# EAGLE design ControlBoardUsb (EAGLE 7.2.0)
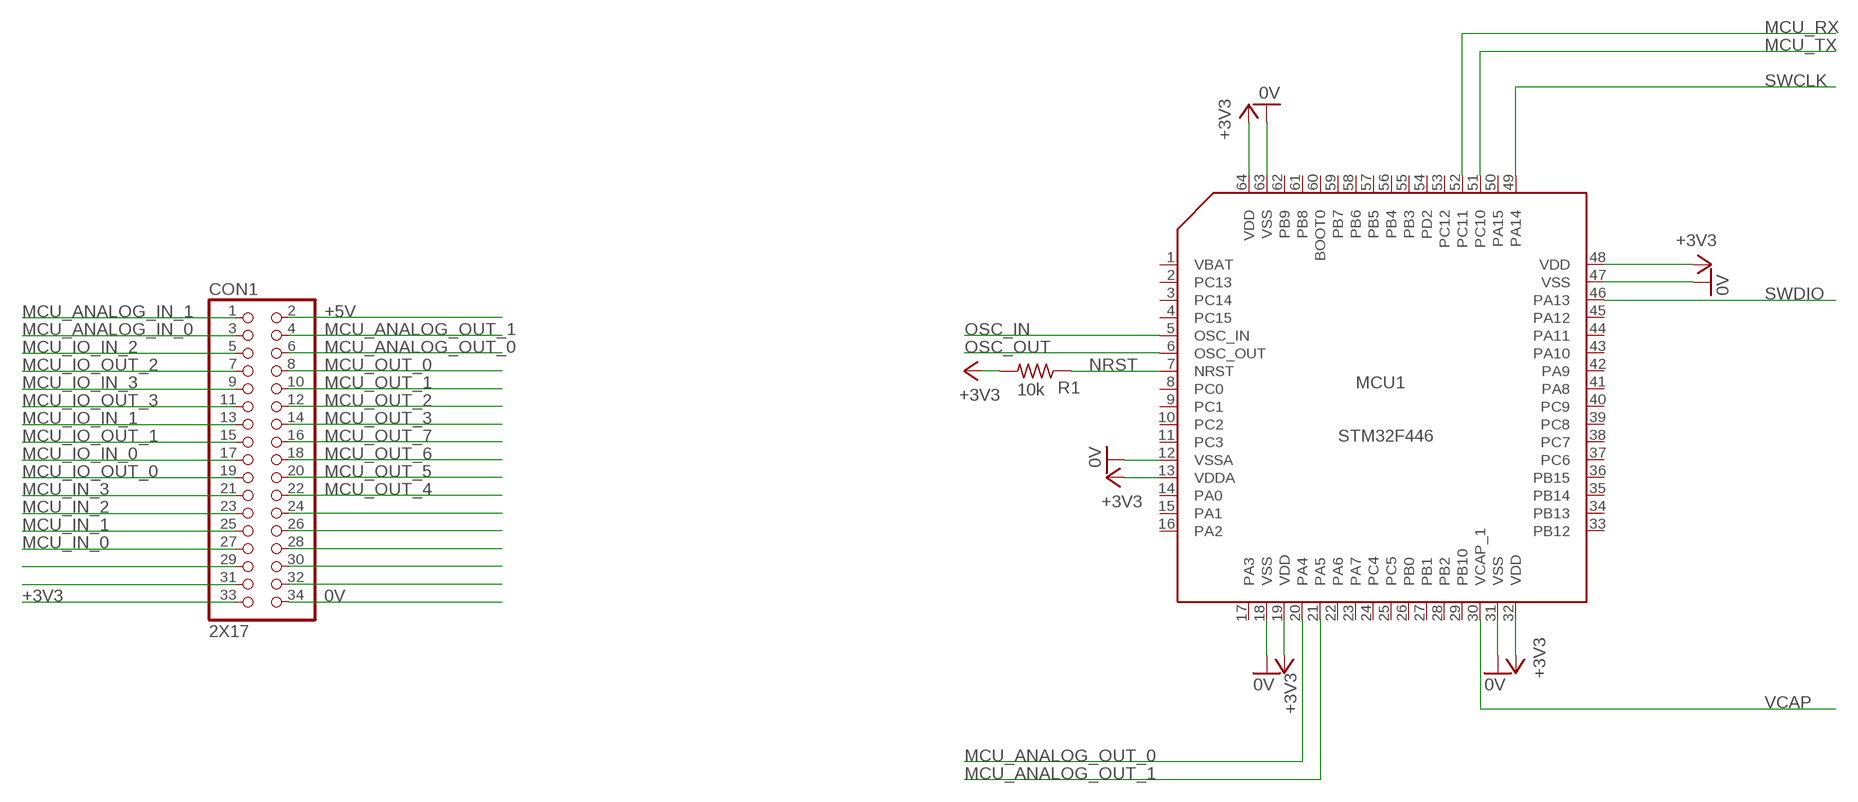
[diagram p0: schematic, sheet 1, part 1 of 2]
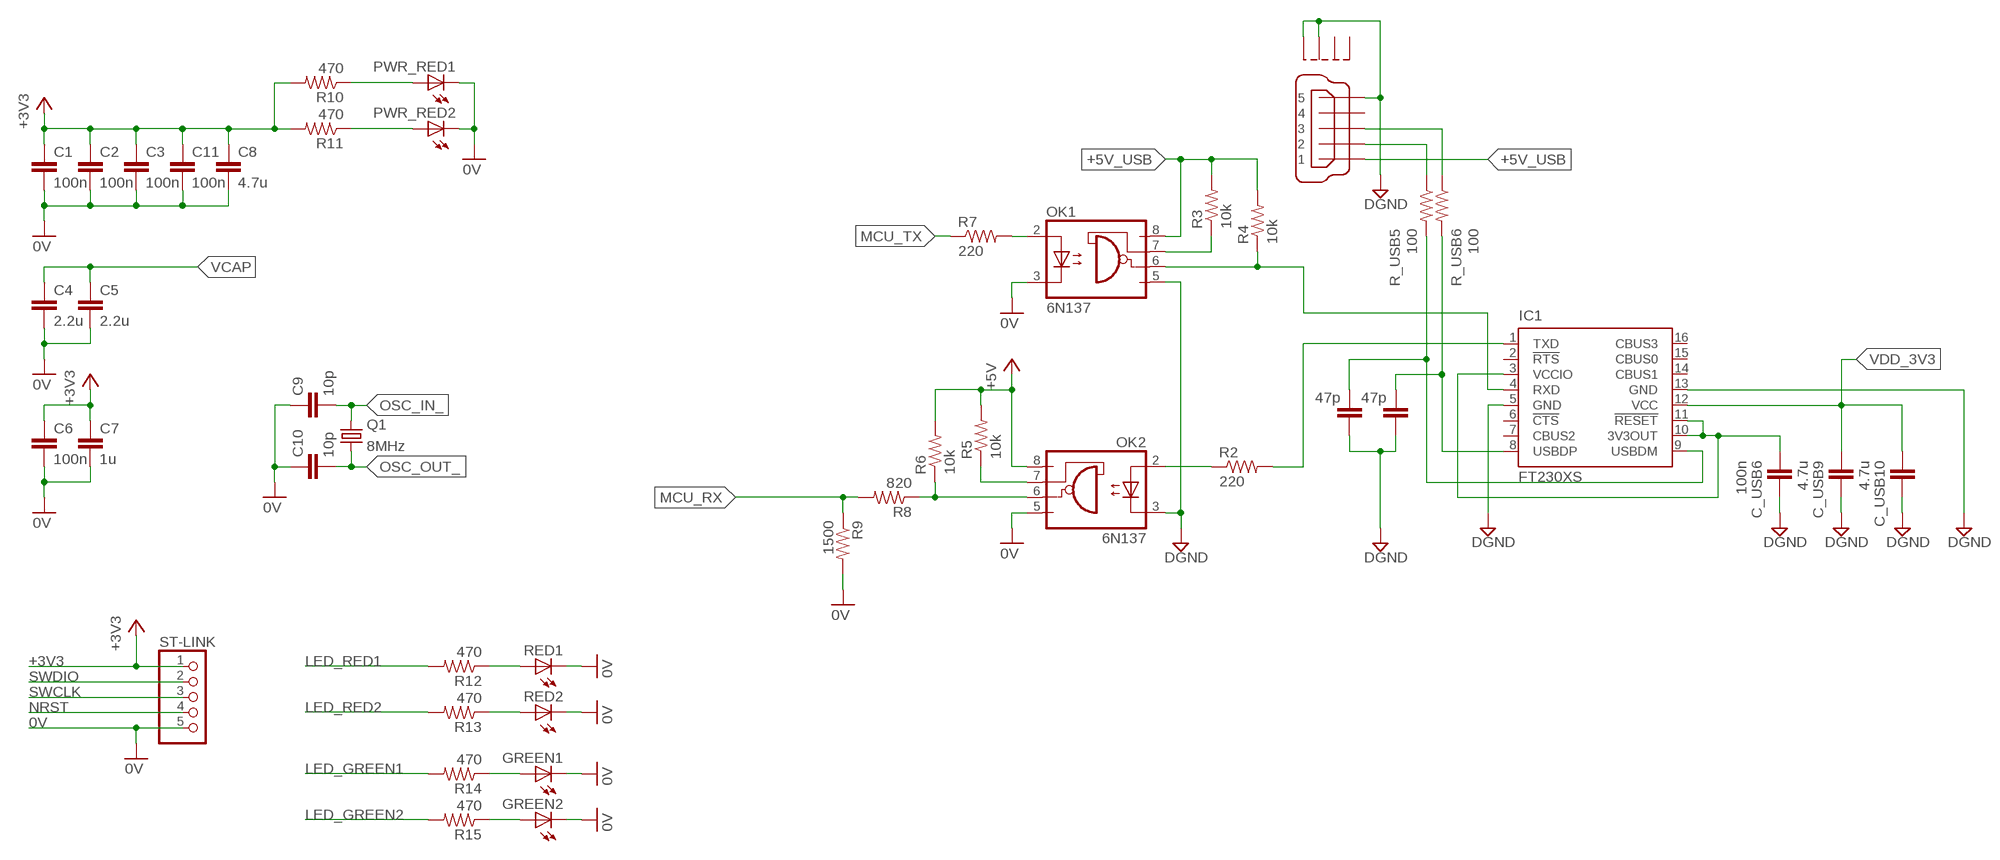
[diagram p1: schematic, sheet 1, part 2 of 2]

## Parts
C1  100n  C-EUC0402  [C0402]
C2  100n  C-EUC0402  [C0402]
C3  100n  C-EUC0402  [C0402]
C4  2.2u  C-EUC0402  [C0402]
C5  2.2u  C-EUC0402  [C0402]
C6  100n  C-EUC0402  [C0402]
C7  1u  C-EUC0402  [C0402]
C8  4.7u  C-EUC0402  [C0402]
C9  10p  C-EUC0402  [C0402]
C10  10p  C-EUC0402  [C0402]
C11  100n  C-EUC0402  [C0402]
C_USB6  100n  C-EUC0402  [C0402]
C_USB7  47p  C-EUC0402  [C0402]
C_USB8  47p  C-EUC0402  [C0402]
C_USB9  4.7u  C-EUC0402  [C0402]
C_USB10  4.7u  C-EUC0402  [C0402]
CON1  2X17  [2X17]
CON3  MICRO_USB_TYPE_A  [MINI_USB_TYPE_A_THOLE]
GREEN1  LEDCHIP-LED0805  [CHIP-LED0805]
GREEN2  LEDCHIP-LED0805  [CHIP-LED0805]
IC1  FT230XS  [SSOP16]
MCU1  STM32F446  [LQFP-64]
OK1  6N137  [DIL08]
OK2  6N137  [DIL08]
PWR_RED1  LEDCHIP-LED0805  [CHIP-LED0805]
PWR_RED2  LEDCHIP-LED0805  [CHIP-LED0805]
Q1  8MHz  CRYSTALHC33U-V  [HC33U-V]
R1  10k  R-US_R0402  [R0402]
R2  220  R-US_R0402  [R0402]
R3  10k  R-US_R0402  [R0402]
R4  10k  R-US_R0402  [R0402]
R5  10k  R-US_R0402  [R0402]
R6  10k  R-US_R0402  [R0402]
R7  220  R-US_R0402  [R0402]
R8  820  R-US_R0402  [R0402]
R9  1500  R-US_R0402  [R0402]
R10  470  R-US_R0402  [R0402]
R11  470  R-US_R0402  [R0402]
R12  470  R-US_R0402  [R0402]
R13  470  R-US_R0402  [R0402]
R14  470  R-US_R0402  [R0402]
R15  470  R-US_R0402  [R0402]
R_USB5  100  R-US_R0402  [R0402]
R_USB6  100  R-US_R0402  [R0402]
RED1  LEDCHIP-LED0805  [CHIP-LED0805]
RED2  LEDCHIP-LED0805  [CHIP-LED0805]
ST-LINK  PINHD-1X5/90  [1X05/90]

## Nets
0V: C1.2 C2.2 C3.2 C4.2 C5.2 C6.2 C7.2 C8.2 C9.1 C10.1 C11.2 CON1.34 GREEN1.C GREEN2.C MCU1.12(VSSA) MCU1.18(VSS) MCU1.31(VSS) MCU1.47(VSS) MCU1.63(VSS) OK1.3(C) OK2.5(GND) PWR_RED1.C PWR_RED2.C R9.2 RED1.C RED2.C ST-LINK.5
+3V3: C1.1 C2.1 C3.1 C6.1 C7.1 C8.1 C11.1 CON1.33 MCU1.13(VDDA) MCU1.19(VDD) MCU1.32(VDD) MCU1.48(VDD) MCU1.64(VDD) R1.2 R10.2 R11.2 ST-LINK.1
+5V: CON1.2 OK2.8(VCC) R5.2 R6.2
+5V_USB: CON3.1 OK1.8(VCC) R3.2 R4.2
DGND: C_USB6.1 C_USB7.1 C_USB8.1 C_USB9.1 C_USB10.1 CON3.5 CON3.M3(S3) CON3.M4(S4) IC1.5(GND) IC1.13(GND) OK1.5(GND) OK2.3(C)
LED_GREEN1: R14.2
LED_GREEN2: R15.2
LED_RED1: R12.2
LED_RED2: R13.2
MCU_ANALOG_IN_0: CON1.3
MCU_ANALOG_IN_1: CON1.1
MCU_ANALOG_OUT_0: CON1.6 MCU1.20(PA4)
MCU_ANALOG_OUT_1: CON1.4 MCU1.21(PA5)
MCU_IN_0: CON1.27
MCU_IN_1: CON1.25
MCU_IN_2: CON1.23
MCU_IN_3: CON1.21
MCU_IO_IN_0: CON1.17
MCU_IO_IN_1: CON1.13
MCU_IO_IN_2: CON1.5
MCU_IO_IN_3: CON1.9
MCU_IO_OUT_0: CON1.19
MCU_IO_OUT_1: CON1.15
MCU_IO_OUT_2: CON1.7
MCU_IO_OUT_3: CON1.11
MCU_OUT_0: CON1.8
MCU_OUT_1: CON1.10
MCU_OUT_2: CON1.12
MCU_OUT_3: CON1.14
MCU_OUT_4: CON1.22
MCU_OUT_5: CON1.20
MCU_OUT_6: CON1.18
MCU_OUT_7: CON1.16
MCU_RX: MCU1.52(PC11) R8.2 R9.1
MCU_TX: MCU1.51(PC10) R7.1
N$1: OK2.2(A) R2.1
N$2: OK2.6(VO) R6.1 R8.1
N$3: OK2.7(VE) R5.1
N$4: OK1.7(VE) R3.1
N$5: PWR_RED1.A R10.1
N$6: OK1.2(A) R7.2
N$7: PWR_RED2.A R11.1
N$8: R12.1 RED1.A
N$10: R13.1 RED2.A
N$12: C_USB6.2 IC1.3(VCCIO) IC1.10(3V3OUT) IC1.11(!RESET)
N$13: GREEN1.A R14.1
N$15: GREEN2.A R15.1
N$16: C_USB8.2 IC1.8(USBDP) R_USB6.2
N$17: C_USB7.2 IC1.9(USBDM) R_USB5.2
N$123: CON1.29
N$124: CON1.31
N$133: CON3.2 R_USB5.1
N$134: CON3.3 R_USB6.1
N$137: CON1.24
N$138: CON1.26
N$139: CON1.28
N$140: CON1.30
N$141: CON1.32
NRST: MCU1.7(NRST) R1.1 ST-LINK.4
OSC_IN: MCU1.5(OSC_IN)
OSC_IN_: C9.2 Q1.2
OSC_OUT: MCU1.6(OSC_OUT)
OSC_OUT_: C10.2 Q1.1
SWCLK: MCU1.49(PA14) ST-LINK.3
SWDIO: MCU1.46(PA13) ST-LINK.2
UART4_RX: IC1.1(TXD) R2.2
UART4_TX: IC1.4(RXD) OK1.6(VO) R4.1
VCAP: C4.1 C5.1 MCU1.30(VCAP_1)
VDD_3V3: C_USB9.2 C_USB10.2 IC1.12(VCC)
Unconnected: CON3.4 CON3.M1(S1) CON3.M2(S2) IC1.2(!RTS) IC1.6(!CTS) IC1.7(CBUS2) IC1.14(CBUS1) IC1.15(CBUS0) IC1.16(CBUS3) MCU1.1(VBAT) MCU1.2(PC13) MCU1.3(PC14) MCU1.4(PC15) MCU1.8(PC0) MCU1.9(PC1) MCU1.10(PC2) MCU1.11(PC3) MCU1.14(PA0) MCU1.15(PA1) MCU1.16(PA2) MCU1.17(PA3) MCU1.22(PA6) MCU1.23(PA7) MCU1.24(PC4) MCU1.25(PC5) MCU1.26(PB0) MCU1.27(PB1) MCU1.28(PB2) MCU1.29(PB10) MCU1.33(PB12) MCU1.34(PB13) MCU1.35(PB14) MCU1.36(PB15) MCU1.37(PC6) MCU1.38(PC7) MCU1.39(PC8) MCU1.40(PC9) MCU1.41(PA8) MCU1.42(PA9) MCU1.43(PA10) MCU1.44(PA11) MCU1.45(PA12) MCU1.50(PA15) MCU1.53(PC12) MCU1.54(PD2) MCU1.55(PB3) MCU1.56(PB4) MCU1.57(PB5) MCU1.58(PB6) MCU1.59(PB7) MCU1.60(BOOT0) MCU1.61(PB8) MCU1.62(PB9)

## Library data of the parts
C1-C11 C_USB6-C_USB10 = rcl:C-EU: CAPACITOR, European symbol
CON1 = CardEdgePads:2X17
CON3 = MICRO_USB_TYPE_A:MICRO_USB_TYPE_A
GREEN1 GREEN2 PWR_RED1 PWR_RED2 RED1 RED2 = led:LED: LED OSRAM: - CHIPLED LG R971, LG N971, LY N971, LG Q971, LY Q971, LO R971, LY R971 LH N974, LH R974 LS Q976, LO Q976, LY Q976 LO Q996 - Hyper CHIPLED LW Q18S LB Q993, LB Q99A, LB R99A - SideLED LS A670, LO A670, LY A670, LG A670, LP A670 LB A673, LV A673, LT A673, LW A673 LH A674 LY A675 LS A676, LA A676, LO A676, LY A676, LW A676 LS A679, LY A679, LG A679 - Hyper Micro SIDELED® LS Y876, LA Y876, LO Y876, LY Y876 LT Y87S - SmartLED LW L88C, LW L88S LB L89C, LB L89S, LG L890 LS L89K, LO L89K, LY L89K LS L896, LA L896, LO L896, LY L896 - TOPLED LS T670, LO T670, LY T670, LG T670, LP T670 LSG T670, LSP T670, LSY T670, LOP T670, LYG T670 LG T671, LOG T671, LSG T671 LB T673, LV T673, LT T673, LW T673 LH T674 LS T676, LA T676, LO T676, LY T676, LB T676, LH T676, LSB T676, LW T676 LB T67C, LV T67C, LT T67C, LS T67K, LO T67K, LY T67K, LW E67C LS E67B, LA E67B, LO E67B, LY E67B, LB E67C, LV E67C, LT E67C LW T67C LS T679, LY T679, LG T679 LS T770, LO T770, LY T770, LG T770, LP T770 LB T773, LV T773, LT T773, LW T773 LH T774 LS E675, LA E675, LY E675, LS T675 LS T776, LA T776, LO T776, LY T776, LB T776 LHGB T686 LT T68C, LB T68C - Hyper Mini TOPLED® LB M676 - Mini TOPLED Santana® LG M470 LS M47K, LO M47K, LY M47K Source: http://www.osram.convergy.de LUXEON: - LUMILED® LXK2-PW12-R00, LXK2-PW12-S00, LXK2-PW14-U00, LXK2-PW14-V00 LXK2-PM12-R00, LXK2-PM12-S00, LXK2-PM14-U00 LXK2-PE12-Q00, LXK2-PE12-R00, LXK2-PE12-S00, LXK2-PE14-T00, LXK2-PE14-U00 LXK2-PB12-K00, LXK2-PB12-L00, LXK2-PB12-M00, LXK2-PB14-N00, LXK2-PB14-P00, LXK2-PB14-Q00 LXK2-PR12-L00, LXK2-PR12-M00, LXK2-PR14-Q00, LXK2-PR14-R00 LXK2-PD12-Q00, LXK2-PD12-R00, LXK2-PD12-S00 LXK2-PH12-R00, LXK2-PH12-S00 LXK2-PL12-P00, LXK2-PL12-Q00, LXK2-PL12-R00 Source: www.luxeon.com KINGBRIGHT: KA-3528ASYC Source: www.kingbright.com
IC1 = ftdichip:FT230X: USB to BASIC UART IC Auto generated by make-symbol-device-package-bsdl.ulp Rev. 43 Source: Data sheet <http://www.ftdichip.com/Support/Documents/DataSheets/ICs/DS_FT230X.pdf>
MCU1 = STM32F446:STM32F446
OK1 OK2 = optocoupler:6N137: MOTOROLA OPTO COUPLER; MPN: 6N137; OC_FARNELL: 1328376; OC_NEWARK: 52M1895
Q1 = crystal:CRYSTAL: CRYSTAL; OC_FARNELL: unknown; OC_NEWARK: unknown
R1-R15 R_USB5 R_USB6 = rcl:R-US_: RESISTOR, American symbol
ST-LINK = pinhead:PINHD-1X5: PIN HEADER

## Board
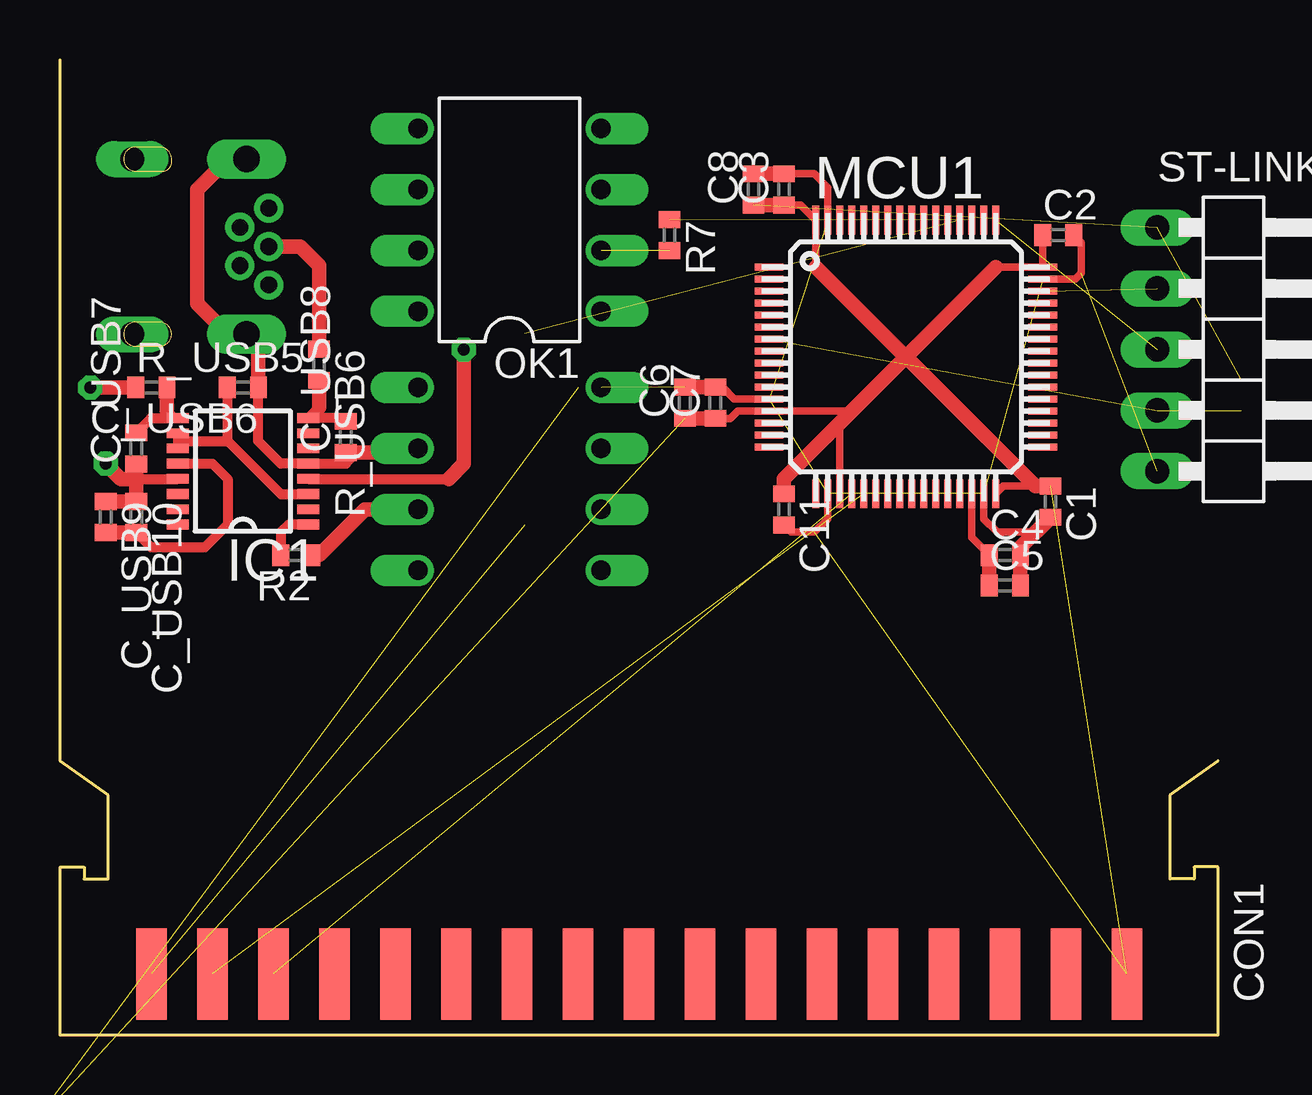
[diagram p2: board, top side]
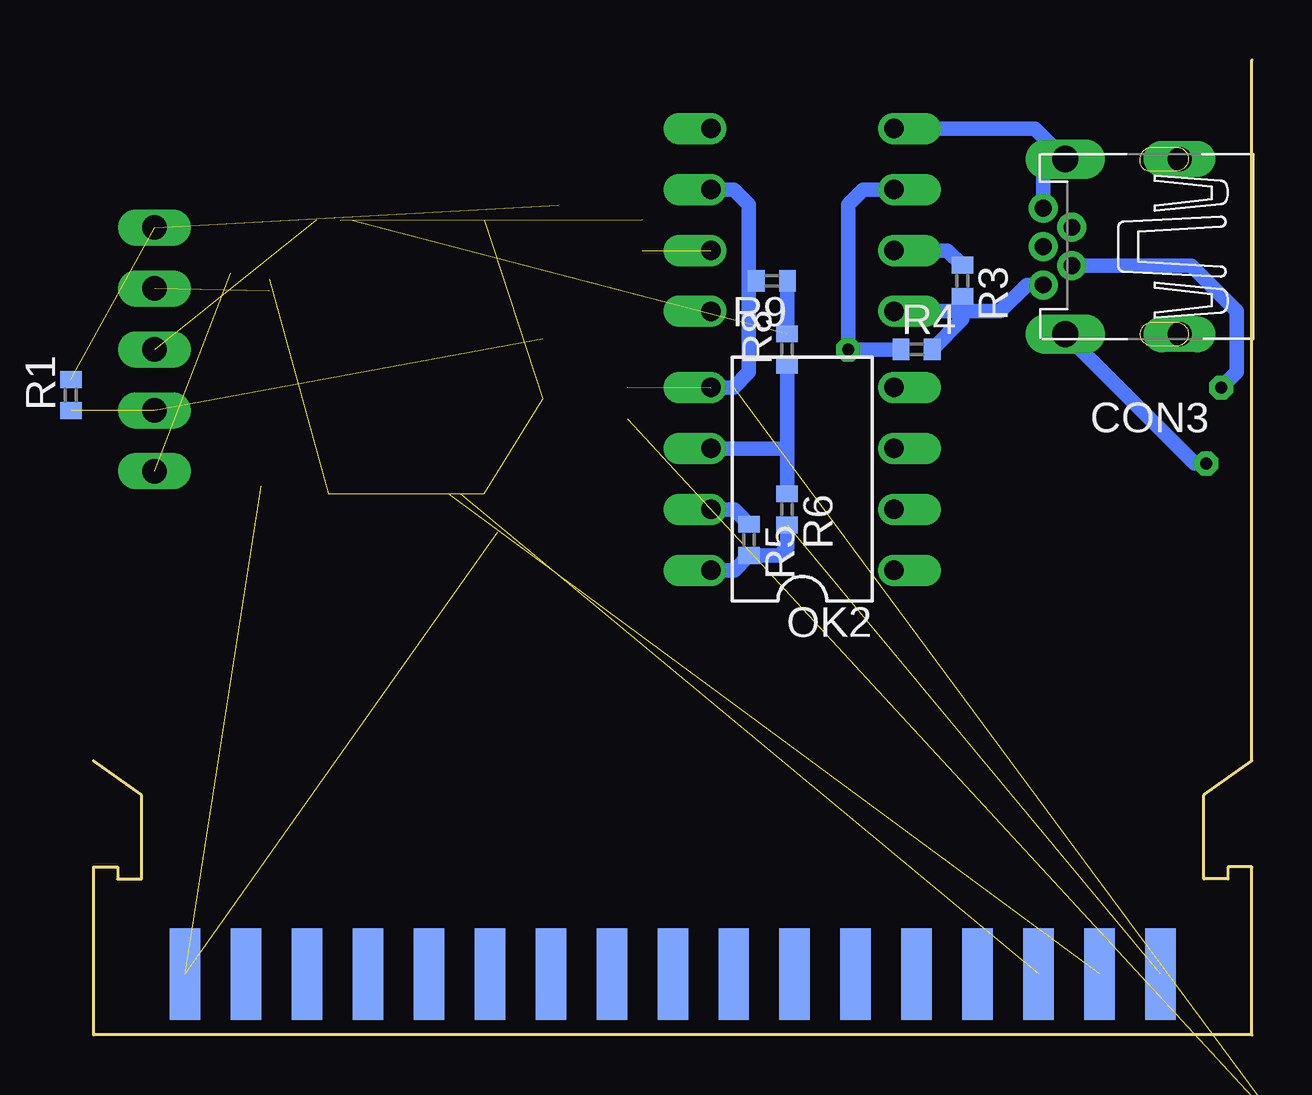
[diagram p3: board, bottom side, seen from below]

Size 48.26 x 40.64 mm. Coordinates in mm from the lower left corner, seen from the top.
Outline: 0,11.43 0,40.64
Copper layers (1*16): Top 0.035mm / dielectric 1.5mm / Bottom 0.035mm
Design rules "default": minimum track width 10mil, minimum drill 24mil, track to track 8mil, track to pad 8mil, pad to pad 8mil, via to via 8mil, smd to smd 8mil, copper to edge 40mil, drill to drill 8mil, minimum pad ring 10mil, minimum via ring 8mil, stop-mask expansion 4mil, vias tented up to drill 0mil, thermal gap 10mil

### Footprints (pad centres in the part's own frame; a part is rotated, then mirrored left to right if it is on the bottom)
C0402 = smd 0.7 x 0.9: 1 -0.65,0; 2 0.65,0
2X17 = smd 1.27 x 3.81: 1 -20.32,0; 3 -17.78,0; 5 -15.24,0; 7 -12.7,0; 9 -10.16,0; 11 -7.62,0; 13 -5.08,0; 15 -2.54,0; 17 0,0; 19 2.54,0; 21 5.08,0; 23 7.62,0; 25 10.16,0; 27 12.7,0; 29 15.24,0; 31 17.78,0; 33 20.32,0 | smd 1.27 x 3.81 bottom: 2 -20.32,0; 4 -17.78,0; 6 -15.24,0; 8 -12.7,0; 10 -10.16,0; 12 -7.62,0; 14 -5.08,0; 16 -2.54,0; 18 0,0; 20 2.54,0; 22 5.08,0; 24 7.62,0; 26 10.16,0; 28 12.7,0; 30 15.24,0; 32 17.78,0; 34 20.32,0
MINI_USB_TYPE_A_THOLE = drill 0.7 pad 1.016: 1 2.825,1.6; 2 1.625,0.8; 3 2.825,0; 4 1.625,-0.8; 5 2.825,-1.6 | drill 1 pad 1.422 long: M1 -2.86,3.65; M2 -2.86,-3.65 | drill 1.1 pad 1.422 long: M3 1.903,3.65; M4 1.903,-3.65
CHIP-LED0805 = smd 1.2 x 1.2: A 0,-1.05; C 0,1.05
SSOP16 = smd 0.914 x 0.406: 1 -2.718,2.223; 2 -2.718,1.587; 3 -2.718,0.953; 4 -2.718,0.318; 5 -2.718,-0.318; 6 -2.718,-0.953; 7 -2.718,-1.587; 8 -2.718,-2.223; 9 2.718,-2.223; 10 2.718,-1.587; 11 2.718,-0.953; 12 2.718,-0.318; 13 2.718,0.318; 14 2.718,0.953; 15 2.718,1.587; 16 2.718,2.223
LQFP-64 = smd 1.2 x 0.3: 1 -5.7,3.75; 2 -5.7,3.25; 3 -5.7,2.75; 4 -5.7,2.25; 5 -5.7,1.75; 6 -5.7,1.25; 7 -5.7,0.75; 8 -5.7,0.25; 9 -5.7,-0.25; 10 -5.7,-0.75; 11 -5.7,-1.25; 12 -5.7,-1.75; 13 -5.7,-2.25; 14 -5.7,-2.75; 15 -5.7,-3.25; 16 -5.7,-3.75; 33 5.7,-3.75; 34 5.7,-3.25; 35 5.7,-2.75; 36 5.7,-2.25; 37 5.7,-1.75; 38 5.7,-1.25; 39 5.7,-0.75; 40 5.7,-0.25; 41 5.7,0.25; 42 5.7,0.75; 43 5.7,1.25; 44 5.7,1.75; 45 5.7,2.25; 46 5.7,2.75; 47 5.7,3.25; 48 5.7,3.75 | smd 0.3 x 1.2: 17 -3.75,-5.7; 18 -3.25,-5.7; 19 -2.75,-5.7; 20 -2.25,-5.7; 21 -1.75,-5.7; 22 -1.25,-5.7; 23 -0.75,-5.7; 24 -0.25,-5.7; 25 0.25,-5.7; 26 0.75,-5.7; 27 1.25,-5.7; 28 1.75,-5.7; 29 2.25,-5.7; 30 2.75,-5.7; 31 3.25,-5.7; 32 3.75,-5.7; 49 3.75,5.7; 50 3.25,5.7; 51 2.75,5.7; 52 2.25,5.7; 53 1.75,5.7; 54 1.25,5.7; 55 0.75,5.7; 56 0.25,5.7; 57 -0.25,5.7; 58 -0.75,5.7; 59 -1.25,5.7; 60 -1.75,5.7; 61 -2.25,5.7; 62 -2.75,5.7; 63 -3.25,5.7; 64 -3.75,5.7
DIL08 = drill 0.813 offset: 1 -3.81,-3.81; 2 -1.27,-3.81; 3 1.27,-3.81; 4 3.81,-3.81; 5 3.81,3.81; 6 1.27,3.81; 7 -1.27,3.81; 8 -3.81,3.81
HC33U-V = drill 1.016: 1 -6.223,0; 2 6.223,0
R0402 = smd 0.7 x 0.9: 1 -0.65,0; 2 0.65,0
1X05/90 = drill 1.016 long: 1 -5.08,-3.81; 2 -2.54,-3.81; 3 0,-3.81; 4 2.54,-3.81; 5 5.08,-3.81

### Placement (x,y rotation side)
C1  41.28,22.23 270 top
C2  41.59,33.34 0 top
C3  30.16,35.24 90 top
C4  39.37,20 0 top
C5  39.37,18.73 0 top
C6  26.04,26.35 90 top
C7  27.31,26.35 90 top
C8  28.89,35.24 90 top
C9  -33.34,-16.51 90 bottom  (outside the outline)
C10  -33.34,-23.49 270 bottom  (outside the outline)
C11  30.16,21.91 270 top
C_USB6  7.62,26.99 180 top
C_USB7  3.17,24.45 90 top
C_USB8  11.91,24.92 90 top
C_USB9  1.91,21.59 270 top
C_USB10  3.17,21.59 270 top
CON1  24.13,2.54 0 top
CON3  5.87,32.86 180 bottom
GREEN1  -20,-45.4 0 top  (outside the outline)
GREEN2  -20,-56.2 0 top  (outside the outline)
IC1  7.62,23.5 180 top
MCU1  35.24,28.26 0 top
OK1  18.73,33.97 90 top
OK2  18.73,23.18 90 bottom
PWR_RED1  -13.97,-13.97 0 top  (outside the outline)
PWR_RED2  -7.94,-13.97 0 top  (outside the outline)
Q1  -33.34,-20 90 top  (outside the outline)
R1  49.21,26.67 90 bottom
R2  9.84,20 180 top
R3  12.06,31.43 270 bottom
R4  13.97,28.57 0 bottom
R5  20.95,20.64 270 bottom
R6  19.37,21.91 270 bottom
R7  25.4,33.34 270 top
R8  19.37,28.57 90 bottom
R9  20,31.43 180 bottom
R10  -15.24,-18.41 0 top  (outside the outline)
R11  -15.24,-23.18 0 top  (outside the outline)
R12  -15.24,-27.94 0 top  (outside the outline)
R13  -21.27,-38.73 0 top  (outside the outline)
R14  -21.27,-49.53 0 top  (outside the outline)
R15  -21.27,-60.33 0 top  (outside the outline)
R_USB5  3.81,26.99 0 top
R_USB6  10.8,27.94 270 top
RED1  -20,-28.58 0 top  (outside the outline)
RED2  -20,-34.61 0 top  (outside the outline)
ST-LINK  49.53,28.57 270 top

### Tracks (layer width: path | path; a pad name or v marks a point on that pad's centre or on a via)
0V  (15 unrouted)
  Top 0.305: MCU1.31 38.49,21.52 39.05,20.96 40.65,20.96 | C11.2 30.46,20.96 31.43,20.96 31.99,21.52 MCU1.18 | C2.2 42.54,33.03 42.54,31.75 42.3,31.51 MCU1.47 | MCU1.12 28.1,26.51 27.61,27 C7.2 | MCU1.63 31.99,35.32 31.42,35.89 C3.2
  Top 0.406: C4.2 40.02,20.32
  Top 0.61: 40.65,20.96 C1.2 40.02,20.32 | C4.2 C5.2 | C7.2 C6.2 | C3.2 C8.2
  Bottom 0.61: OK2.5 21.59,26.99 20.95,27.62 20.95,31.43 | R9.2 20.95,31.43 | 20.95,31.43 20.95,34.61 21.59,35.24 OK1.3
+3V3  (5 unrouted)
  Top 0.305: MCU1.32 39.31,22.88 40.64,22.88 | 38.99,32.01 MCU1.48 C2.1 | MCU1.19 32.49,25.51 | C7.1 27.93,25.7 28.23,26.01 MCU1.13 32.99,26.01 33.02,26.04 | C3.1 30.86,34.59 MCU1.64 31.49,32.01 | 35.24,28.26 35.26,28.26
  Top 0.61: C1.1 40.64,22.88 35.26,28.26 | C11.1 30.16,23.18 32.49,25.51 33.02,26.04 35.24,28.26 | 35.24,28.26 38.99,32.01 | C7.1 C6.1 | C3.1 C8.1 | 31.49,32.01 35.24,28.26
+5V  (1 unrouted)
  Bottom 0.61: OK2.8 21.57,19.37 R5.2 19.7,19.99 19.37,20.32 R6.2
+5V_USB
  Bottom 0.61: CON3.1 9.38,31.26 10.48,30.16 12.06,30.16 | 12.06,30.16 OK1.8 | 12.06,30.16 R3.2 12.06,29.83 R4.2
DGND  (via drill 0.5 pad 1)
  Top 0.406: C_USB6.1 8.26,26.97 8.26,24.77 9.21,23.81 IC1.5 11.91,23.81 12.22,24.13 C_USB8.1 | 3.17,23.18 IC1.13
  Top 0.61: C_USB8.1 14.75,24.27 OK2.3 | C_USB7.1 3.17,23.18 | 3.17,23.18 C_USB10.1 C_USB9.1 | C_USB6.1 8.27,28.72 CON3.M3 6.98,29.21 5.71,30.48 5.71,35.24 6.98,36.51 CON3.M4 | v1.9,23.81 2.54,23.18 3.17,23.18
  Bottom 0.61: CON3.5 8.7,36.51 CON3.M4 9.05,37.78 OK1.5 | v1.9,23.81 2.38,23.81 CON3.M3
MCU_ANALOG_OUT_0  (1 unrouted)
MCU_ANALOG_OUT_1  (1 unrouted)
MCU_RX  (1 unrouted)
  Bottom 0.61: R8.2 19.37,31.42 R9.1
MCU_TX  (1 unrouted)
N$1
  Top 0.61: R2.1 10.79,20 12.7,21.91 OK2.2
N$2
  Bottom 0.61: 19.37,23.18 R6.1 19.37,24.45 | R8.1 19.37,24.45 | OK2.6 19.37,24.45
N$3
  Bottom 0.61: R5.1 21.57,21.91 OK2.7
N$4
  Bottom 0.61: R3.1 12.68,32.7 OK1.7
N$5  (1 unrouted)
N$6  (1 unrouted)
N$7  (1 unrouted)
N$8  (1 unrouted)
N$10  (1 unrouted)
N$12
  Top 0.406: IC1.10 IC1.11 5.22,24.77 6.98,24.77 | 6.98,24.77 9.21,22.54 IC1.3 | C_USB6.2 6.97,24.78 6.98,24.77
N$13  (1 unrouted)
N$15  (1 unrouted)
N$16
  Top 0.406: 10.79,26.18 IC1.8 12.08,25.72 C_USB8.2
  Top 0.61: 10.79,26.18 R_USB6.2
N$17
  Top 0.406: C_USB7.2 3.79,25.72 IC1.9 4.76,25.72 4.45,26.04 | R_USB5.2 4.45,26.97
  Top 0.61: 4.45,26.97 4.45,26.04
N$133  (via drill 0.5 pad 1)
  Top 0.61: R_USB5.1 v1.27,26.99
  Bottom 0.61: v1.27,26.99 0.64,27.62 0.64,30.16 2.53,32.06 CON3.2
N$134
  Top 0.61: R_USB6.1 10.79,32.07 10,32.86 CON3.3
NRST  (2 unrouted)
OSC_IN_  (1 unrouted)
OSC_OUT_  (1 unrouted)
SWCLK  (1 unrouted)
SWDIO  (1 unrouted)
UART4_RX
  Top 0.406: IC1.1 9.53,21.27 9.21,20.96 9.21,20.02 R2.2
UART4_TX  (via drill 0.5 pad 1)
  Top 0.406: IC1.4 16.19,23.18
  Top 0.61: 16.19,23.18 16.83,23.81 v16.83,28.57
  Bottom 0.61: R4.1 16.19,28.57 v16.83,28.57 16.83,34.61 16.19,35.24 OK1.6
VCAP
  Top 0.305: MCU1.30 37.99,20.73 C4.1
  Top 0.61: C4.1 C5.1
VDD_3V3
  Top 0.406: IC1.12 6.35,23.81 6.98,23.18 6.98,21.27 6.03,20.32 3.79,20.32 C_USB10.2
  Top 0.61: C_USB9.2 C_USB10.2